# Altium schematic sheet [3] CAN.SchDoc
size A4
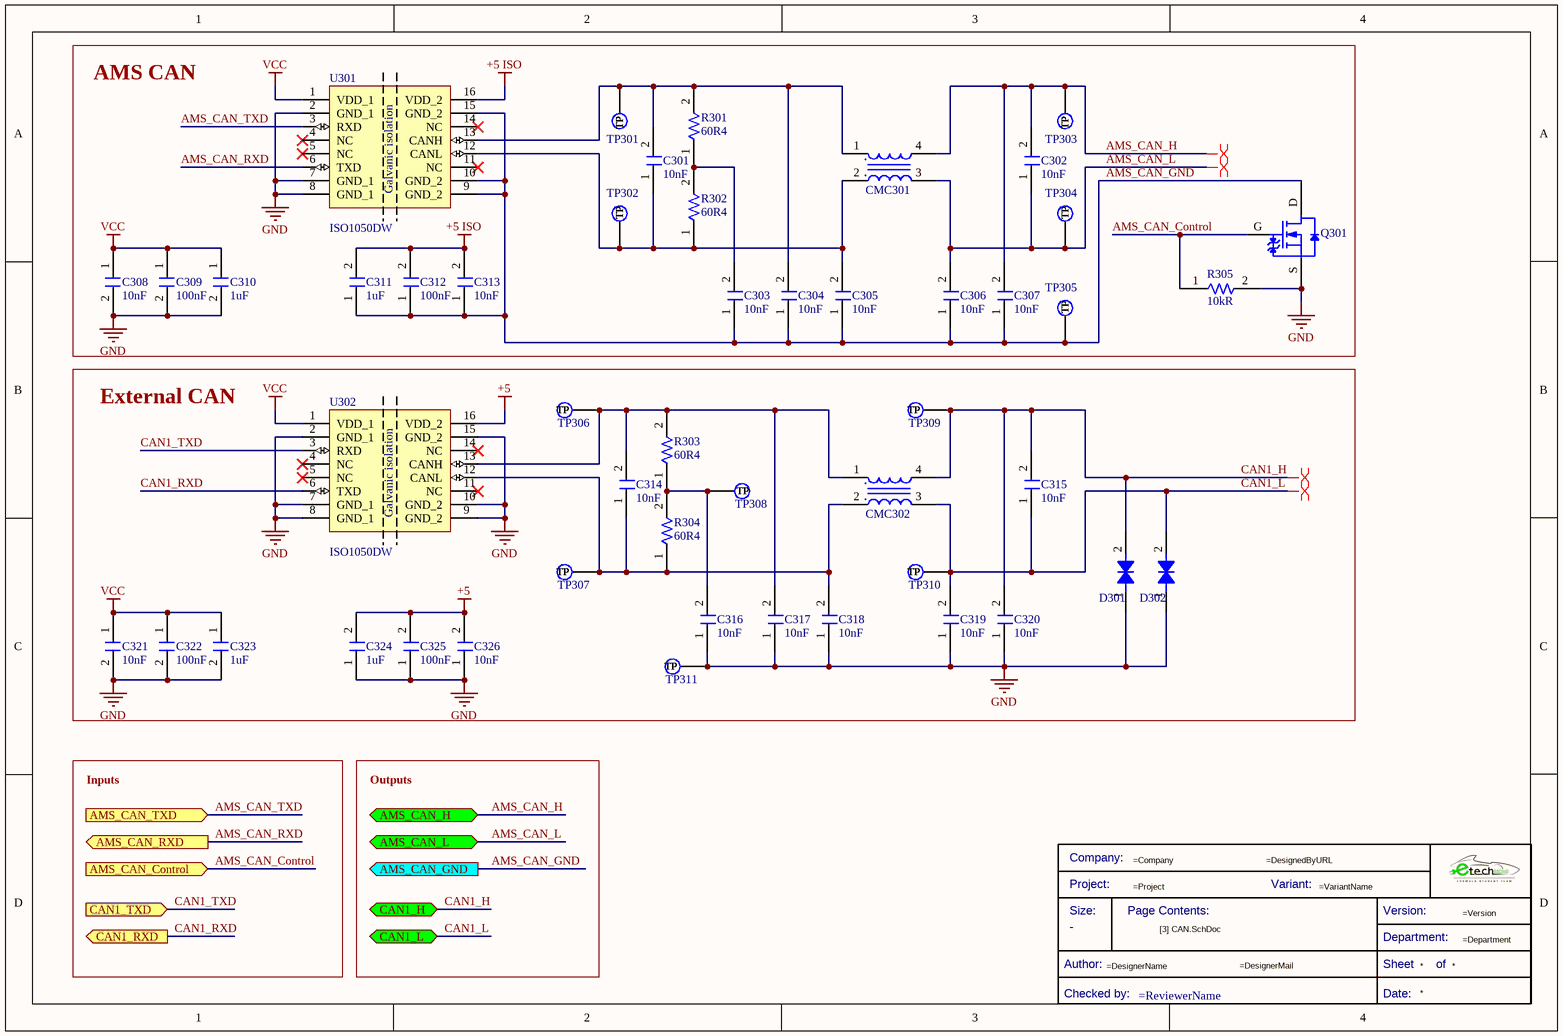
[diagram p0: [3] CAN.SchDoc]

## Parts
*  Title Block_template  (value not drawn)  (graphical)
C301  Capacitance: 10nF  [C0805FNPC-R]  (hidden comment: 885012207092)
C302  Capacitance: 10nF  [C0805FNPC-R]  (hidden comment: 885012207092)
C303  Capacitance: 10nF  [C0805FNPC-R]  (hidden comment: 885012207092)
C304  Capacitance: 10nF  [C0805FNPC-R]  (hidden comment: 885012207092)
C305  Capacitance: 10nF  [C0805FNPC-R]  (hidden comment: 885012207092)
C306  Capacitance: 10nF  [C0805FNPC-R]  (hidden comment: 885012207092)
C307  Capacitance: 10nF  [C0805FNPC-R]  (hidden comment: 885012207092)
C308  Capacitance: 10nF  [C0805FNPC-R]  (hidden comment: 885012207092)
C309  Capacitance: 100nF  [C0805FNPC-R]  (hidden comment: 885012207098)
C310  Capacitance: 1uF  [C0805FNPC-R]  (hidden comment: 885012207103)
C311  Capacitance: 1uF  [C0805FNPC-R]  (hidden comment: 885012207103)
C312  Capacitance: 100nF  [C0805FNPC-R]  (hidden comment: 885012207098)
C313  Capacitance: 10nF  [C0805FNPC-R]  (hidden comment: 885012207092)
C314  Capacitance: 10nF  [C0805FNPC-R]  (hidden comment: 885012207092)
C315  Capacitance: 10nF  [C0805FNPC-R]  (hidden comment: 885012207092)
C316  Capacitance: 10nF  [C0805FNPC-R]  (hidden comment: 885012207092)
C317  Capacitance: 10nF  [C0805FNPC-R]  (hidden comment: 885012207092)
C318  Capacitance: 10nF  [C0805FNPC-R]  (hidden comment: 885012207092)
C319  Capacitance: 10nF  [C0805FNPC-R]  (hidden comment: 885012207092)
C320  Capacitance: 10nF  [C0805FNPC-R]  (hidden comment: 885012207092)
C321  Capacitance: 10nF  [C0805FNPC-R]  (hidden comment: 885012207092)
C322  Capacitance: 100nF  [C0805FNPC-R]  (hidden comment: 885012207098)
C323  Capacitance: 1uF  [C0805FNPC-R]  (hidden comment: 885012207103)
C324  Capacitance: 1uF  [C0805FNPC-R]  (hidden comment: 885012207103)
C325  Capacitance: 100nF  [C0805FNPC-R]  (hidden comment: 885012207098)
C326  Capacitance: 10nF  [C0805FNPC-R]  (hidden comment: 885012207092)
CMC301  744226  [CMC_10u_1.6A]  (value not drawn)
CMC302  744226  [CMC_10u_1.6A]  (value not drawn)
D301  824501600  [DTVS-DO-214AC]  (value not drawn)
D302  824501600  [DTVS-DO-214AC]  (value not drawn)
Q301  CPH3455-TL-H  [TRT-NCH-3/35-CPH]  (value not drawn)
R301  value 60R4  [R0805FTK]  (hidden comment: R60-0805FTN)
R302  value 60R4  [R0805FTK]  (hidden comment: R60-0805FTN)
R303  value 60R4  [R0805FTK]  (hidden comment: R60-0805FTN)
R304  value 60R4  [R0805FTK]  (hidden comment: R60-0805FTN)
R305  Resistance: 10kR  [R0805FTK]  (hidden comment: CR0805-JW-103ELF)
TP301  TestPoint  [TestPoint]  (value not drawn)  (no BOM)
TP302  TestPoint  [TestPoint]  (value not drawn)  (no BOM)
TP303  TestPoint  [TestPoint]  (value not drawn)  (no BOM)
TP304  TestPoint  [TestPoint]  (value not drawn)  (no BOM)
TP305  TestPoint  [TestPoint]  (value not drawn)  (no BOM)
TP306  TestPoint  [TestPoint]  (value not drawn)  (no BOM)
TP307  TestPoint  [TestPoint]  (value not drawn)  (no BOM)
TP308  TestPoint  [TestPoint]  (value not drawn)  (no BOM)
TP309  TestPoint  [TestPoint]  (value not drawn)  (no BOM)
TP310  TestPoint  [TestPoint]  (value not drawn)  (no BOM)
TP311  TestPoint  [TestPoint]  (value not drawn)  (no BOM)
U301  ISO1050DW  [TRANSCEIVER_CAN_SOIC16]
U302  ISO1050DW  [TRANSCEIVER_CAN_SOIC16]

## Blocks framed on the sheet
AMS CAN: C301-C313 CMC301 Q301 R301 R302 R305 TP301-TP305 U301
External CAN: C314-C326 CMC302 D301 D302 R303 R304 TP306-TP311 U302

## Ports
AMS_CAN_Control (in), AMS_CAN_GND (out), AMS_CAN_H (bidir), AMS_CAN_L (bidir), AMS_CAN_RXD (out), AMS_CAN_TXD (in), CAN1_H (bidir), CAN1_L (bidir), CAN1_RXD (out), CAN1_TXD (in)

## Nets
+5: C324.2 C325.2 C326.2 U302.16(VDD_2)
+5 ISO: C311.2 C312.2 C313.2 U301.16(VDD_2)
GND: C308.2 C309.2 C310.2 C316.1 C317.1 C318.1 C319.1 C320.1 C321.2 C322.2 C323.2 C324.1 C325.1 C326.1 D301.1 D302.1 Q301.S R305.2 TP311.1(TP) U301.2(GND_1) U301.7(GND_1) U301.8(GND_1) U302.2(GND_1) U302.7(GND_1) U302.8(GND_1) U302.9(GND_2) U302.10(GND_2) U302.15(GND_2)
VCC: C308.1 C309.1 C310.1 C321.1 C322.1 C323.1 U301.1(VDD_1) U302.1(VDD_1)
AMS_CAN_Control: Q301.G R305.1 ; port AMS_CAN_Control
AMS_CAN_GND: C303.1 C304.1 C305.1 C306.1 C307.1 C311.1 C312.1 C313.1 Q301.D TP305.1(TP) U301.9(GND_2) U301.10(GND_2) U301.15(GND_2) ; port AMS_CAN_GND
AMS_CAN_H: C302.2 C307.2 CMC301.4(4_OUT) TP303.1(TP) ; port AMS_CAN_H
AMS_CAN_L: C302.1 C306.2 CMC301.3(3_OUT) TP304.1(TP) ; port AMS_CAN_L
AMS_CAN_RXD: U301.6(TXD) ; port AMS_CAN_RXD
AMS_CAN_TXD: U301.3(RXD) ; port AMS_CAN_TXD
CAN1_H: C315.2 C320.2 CMC302.4(4_OUT) D301.2 TP309.1(TP) ; port CAN1_H
CAN1_L: C315.1 C319.2 CMC302.3(3_OUT) D302.2 TP310.1(TP) ; port CAN1_L
CAN1_RXD: U302.6(TXD) ; port CAN1_RXD
CAN1_TXD: U302.3(RXD) ; port CAN1_TXD
NetC301_1: C301.1 C305.2 CMC301.2(2_IN) R302.1 TP302.1(TP) U301.12(CANL)
NetC301_2: C301.2 C304.2 CMC301.1(1_IN) R301.2 TP301.1(TP) U301.13(CANH)
NetC303_2: C303.2 R301.1 R302.2
NetC314_1: C314.1 C318.2 CMC302.2(2_IN) R304.1 TP307.1(TP) U302.12(CANL)
NetC314_2: C314.2 C317.2 CMC302.1(1_IN) R303.2 TP306.1(TP) U302.13(CANH)
NetC316_2: C316.2 R303.1 R304.2 TP308.1(TP)

Not connected (* = marked no-connect by the designer): U301 4(NC)* 5(NC)* 11(NC)* 14(NC)*; U302 4(NC)* 5(NC)* 11(NC)* 14(NC)*

## Layout directives
differential pair: AMS_CAN_H, AMS_CAN_L, CAN1_H, CAN1_L

## Notes on the sheet
- Inputs
- Outputs
- Title
- Size:
- Date:
- A4
- Number:
- Time:
- Revision:
- Sheet
- of
- File:
- (in symbol Title Block_template) Company:; Project:; Variant:; Size:; Page Contents:; Version:; Department:; Author:; Sheet; of; Checked by:; Date:
- (in symbol Transceiver_CAN_ISO1050) Galvanic isolation

## Library data of the parts
* = Title Block_template: Standard Title Block; Category: Title Block; Checked by:: =ReviewerName; Size: -
C301-C308 C313-C321 C326 = C10n-50V-0805FNPC-X7R: Cap, 0.01ΜF, 50V, 10%, X7R, 0805; Manufacturer 1: Wurth Electronics; .Creator: DR; Supplier 1: RSComponents; Manufacturer Part Number 1: 885012207092; RoHS: Yes; Category: Ceramic Capacitors; Stock 1: 1; Pricing 1: 4000=0,03200, 12000=0,03100 (USD); Mount: Surface Mount; Case/Package: 0805; Case Code (Metric): 2012; Case Code (Imperial): 0805; Min Operating Temperature: -55°C; Max Operating Temperature: 125°C; Packaging: Cut Tape; Voltage Rating: 50V; Dielectric: X7R; Tolerance: 10%; Voltage Rating (DC): 50V; Length: 0.079inch; Width: 0.049inch; Thickness: 0.035inch; REACH SVHC: Unknown; RoHS Compliant: Yes; ComponentLink1URL: http://www.farnell.com/datasheets/1958497.pdf?src-supplier=Farnell; ComponentLink1Description: http://www.farnell.com/datasheets/1958497.pdf?src-supplier=Farnell; ComponentLink2URL: http://www.farnell.com/datasheets/1958497.pdf?src-supplier=Element14; ComponentLink2Description: http://www.farnell.com/datasheets/1958497.pdf?src-supplier=Element14; ComponentLink3URL: http://www.farnell.com/datasheets/1958497.pdf?src-supplier=Newark; ComponentLink3Description: http://www.farnell.com/datasheets/1958497.pdf?src-supplier=Newark; ComponentLink4URL: https://katalog.we-online.de/pbs/datasheet/885012207092.pdf?src-supplier=Digi-Key; ComponentLink4Description: https://katalog.we-online.de/pbs/datasheet/885012207092.pdf?src-supplier=Digi-Key; Supplier Part Number 1: 1813941
C309 C312 C322 C325 = C100n-50V-0805FNPC-X7R: Cap, 0.1ΜF, 50V, 10%, X7R, 0805; Manufacturer 1: Wurth Electronics; .Creator: DR; Supplier 1: RSComponents; Manufacturer Part Number 1: 885012207098; RoHS: Yes; Category: Ceramic Capacitors; Stock 1: 8000; Pricing 1: 100=0,10200, 500=0,07100, 2000=0,06100 (GBP); Mount: Surface Mount; Case/Package: 0805; Case Code (Metric): 2012; Case Code (Imperial): 0805; Min Operating Temperature: -55°C; Max Operating Temperature: 125°C; Packaging: Cut Tape; Voltage Rating: 50V; Dielectric: X7R; Tolerance: 10%; Voltage Rating (DC): 50V; Length: 0.079inch; Width: 0.049inch; Thickness: 0.035inch; REACH SVHC: Unknown; RoHS Compliant: Yes; ComponentLink1URL: http://www.farnell.com/datasheets/1958498.pdf?src-supplier=Farnell; ComponentLink1Description: http://www.farnell.com/datasheets/1958498.pdf?src-supplier=Farnell; ComponentLink2URL: http://www.farnell.com/datasheets/1958498.pdf?src-supplier=Element14; ComponentLink2Description: http://www.farnell.com/datasheets/1958498.pdf?src-supplier=Element14; ComponentLink3URL: https://katalog.we-online.de/pbs/datasheet/885012207098.pdf?src-supplier=Digi-Key; ComponentLink3Description: https://katalog.we-online.de/pbs/datasheet/885012207098.pdf?src-supplier=Digi-Key; ComponentLink4URL: http://www.farnell.com/datasheets/1958498.pdf?src-supplier=Newark; ComponentLink4Description: http://www.farnell.com/datasheets/1958498.pdf?src-supplier=Newark; Supplier Part Number 1: 1813493
C310 C311 C323 C324 = C1u-50V-0805FNPC-X7R: Multilayer Ceramic Capacitor, Wcap-Csgp Series, 1 F, 10%, X7R, 50 V, 0805 [2012 Metric] Rohs Compliant: Yes; Manufacturer 1: Wurth Electronics; Voltage Rating: 50V; .Creator: GP; Supplier 1: RSComponents; Manufacturer Part Number 1: 885012207103; RoHS: Yes; Category: Ceramic Capacitors; Stock 1: 5100; Pricing 1: 50=0,27200, 250=0,25300, 500=0,22800, 1250=0,20100, 2500=0,17100 (GBP); Mount: Surface Mount; Case/Package: 0805; Case Code (Metric): 2012; Case Code (Imperial): 0805; Min Operating Temperature: -55°C; Max Operating Temperature: 85°C; Packaging: Cut Tape; Dielectric: X7R; Tolerance: 10%; Voltage Rating (DC): 50V; Length: 0.079inch; Width: 0.049inch; Thickness: 0.053inch; REACH SVHC: Unknown; RoHS Compliant: Yes; ComponentLink1URL: http://www.farnell.com/datasheets/1958501.pdf?src-supplier=Farnell; ComponentLink1Description: http://www.farnell.com/datasheets/1958501.pdf?src-supplier=Farnell; ComponentLink2URL: http://www.farnell.com/datasheets/1958501.pdf?src-supplier=Element14; ComponentLink2Description: http://www.farnell.com/datasheets/1958501.pdf?src-supplier=Element14; ComponentLink3URL: https://katalog.we-online.de/pbs/datasheet/885012107003.pdf?src-supplier=Digi-Key; ComponentLink3Description: https://katalog.we-online.de/pbs/datasheet/885012107003.pdf?src-supplier=Digi-Key; ComponentLink4URL: http://www.farnell.com/datasheets/1958501.pdf?src-supplier=Newark; ComponentLink4Description: http://www.farnell.com/datasheets/1958501.pdf?src-supplier=Newark; Supplier Part Number 1: 1813523
CMC301 CMC302 = CMC_10u_1.6A: Common Mode Chokes Dual 10uH 920Ohm 1kHz 1.6A 80mOhm DCR SMD T/R; Manufacturer: Wurth Electronics; Core Material: Ferrite; Voltage Rating: 80V; Tolerance: 30%; Impedance: 920R; Resistance: 80mR; Number of Lines: 2; .Creator: GP; Category: Common Mode Line Filter; ComponentLink1Description: Datasheet; ComponentLink1URL: https://www.we-online.com/catalog/datasheet/744226.pdf; ComponentLink2Description: Where buy it; ComponentLink2URL: https://www.we-online.com/catalog/en/WE-SL2?sq=744226#744226; Supplier 1: Digi-Key; Manufacturer Part Number: 744226; RoHS: Yes; Stock 1: 1943; Pricing 1: 1=2,55000, 10=2,51500, 50=2,27200, 100=2,19100, 500=2,02900 (USD); Mount: Surface Mount; Case/Package: SMD/SMT; Number of Pins: 4; Weight: 0.017672oz; Min Operating Temperature: -40°C; Max Operating Temperature: 125°C; Packaging: Tape and Reel; Package Quantity: 1; Termination: SMD/SMT; Series: WE-SL2; Inductance: 10uH; Voltage Rating (DC): 80V; Current Rating: 1.6A; Max DC Current: 1.6A; DC Resistance (DCR): 80mR; Test Frequency: 1kHz; Current: 1.6A; Inductance Tolerance: 30%; DC Current: 1.6A; Length: 9.2mm; Width: 6mm; Height: 5mm; Depth: 6.3mm; RoHS Compliant: Yes; REACH SVHC: No SVHC; Lead Free: Lead Free; Supplier Part Number 1: 732-1475-1-ND
D301 D302 = DTVS-6V-DO-214AC: TVS diode [Würth Elektronik] 824501600 TVS diode; Manufacturer: Wurth Electronics; Number of Bidirectional Channels: 1; Reverse Standoff Voltage: 6V; Min Breakdown Voltage: 7.02V; Clamping Voltage: 10.3V; Peak Pulse Power: 400W; Power Line Protection: No; Polarity: Bidirectional; Peak Pulse Current: 38.8A; .Creator: DO; ComponentLink1Description: Where buy it; ComponentLink1URL: https://www.we-online.com/catalog/en/WE-TVSP?sq=824501600#824501600; Supplier 1: Mouser; Manufacturer Part Number: 824501600; RoHS: Yes; Category: TVS Diodes; Stock 1: 780; Pricing 1: 1=0,28000, 10=0,26100, 50=0,26100, 100=0,23400, 500=0,20400, 1000=0,17400, 10000=0,17400 (USD); Mount: Surface Mount; Number of Pins: 2; Min Operating Temperature: -65°C; Max Operating Temperature: 150°C; Packaging: Cut Tape; Max Breakdown Voltage: 7.02V; Resistor Type: Zener; REACH SVHC: Unknown; RoHS Compliant: Yes; ComponentLink2URL: http://www.farnell.com/datasheets/2036401.pdf?src-supplier=Element14; ComponentLink2Description: http://www.farnell.com/datasheets/2036401.pdf?src-supplier=Element14; Supplier Part Number 1: 710-824501600; ComponentLink3URL: https://katalog.we-online.de/pbs/datasheet/824501600.pdf?src-supplier=Digi-Key; ComponentLink3Description: https://katalog.we-online.de/pbs/datasheet/824501600.pdf?src-supplier=Digi-Key
Q301 = TRT-NCH-3/35-CPH: CPH3455-TL-H N-channel MOSFET Transistor; 3 A; 35 V; 3-Pin CPH; Manufacturer: ON Semiconductor; Rds On Max: 104mR; Input Capacitance: 186pF; Rise Time: 4.7ns; Drain to Source Voltage (Vdss): 35V; Continuous Drain Current (ID): 3A; Max Power Dissipation: 1W; Drain to Source Resistance: 108mR; Turn-On Delay Time: 4.2ns; Turn-Off Delay Time: 15ns; Fall Time: 5.7ns; Element Configuration: Single; Gate to Source Voltage (Vgs): 20V; .Creator: GP; Category: Transistor; ComponentLink1Description: Datasheet; ComponentLink1URL: https://docs.rs-online.com/5847/0900766b812d514d.pdf; ComponentLink2Description: Where buy it; ComponentLink2URL: https://es.rs-online.com/web/p/mosfet/8009989; Supplier 1: RSComponents; Manufacturer Part Number: CPH3455-TL-H; RoHS: Yes; Stock 1: 1; Pricing 1: 50=0,50400 (USD); Case/Package: SC; Number of Pins: 3; Min Operating Temperature: -55°C; Max Operating Temperature: 150°C; Package Quantity: 3000; Packaging: Tape and Reel; Drain to Source Breakdown Voltage: 35V; Power Dissipation: 1W; Polarity: N-CHANNEL; Series: -; Length: 2.9mm; Width: 1.6mm; Height: 0.9mm; Lead Free: Lead Free; Halogen Free: Halogen Free; RoHS Compliant: Yes; ComponentLink3URL: https://datasheet.ciiva.com/947/cph3455-d-947201.pdf?src-supplier=Digi-Key; ComponentLink3Description: https://datasheet.ciiva.com/947/cph3455-d-947201.pdf?src-supplier=Digi-Key; ComponentLink4URL: https://datasheet.ciiva.com/4444/cph3455-d-91653-4444616.pdf?src-supplier=Mouser; ComponentLink4Description: https://datasheet.ciiva.com/4444/cph3455-d-91653-4444616.pdf?src-supplier=Mouser; ComponentLink5URL: https://datasheet.ciiva.com/11164/cph3455-d-11164889.pdf?src-supplier=Avnet; ComponentLink5Description: https://datasheet.ciiva.com/11164/cph3455-d-11164889.pdf?src-supplier=Avnet; Supplier Part Number 1: 8009989
R301-R304 = R60-0805FTN: Res Thin Film 0805 60.4 Ohm 0.1% 1/8W ±25ppm/°C Molded SMD SMD Punched Carrier T/R; Manufacturer 1: Panasonic; Manufacturer Part Number 1: ERA-6AEB60R4V; Resistance: 60.4R; Voltage Rating (DC): 100V; Max Power Dissipation: 125mW; Voltage Rating: 200V; .Creator: DR; Supplier 1: Arrow Electronics; RoHS: Yes; Category: Chip SMD Resistors; Stock 1: 5000; Pricing 1: 1=0,04650, 10=0,03900, 100=0,02860 (USD); Mount: Surface Mount; Case/Package: 0805; Number of Pins: 2; Contact Plating: Tin; Weight: 0.000194oz; Case Code (Metric): 2012; Case Code (Imperial): 0805; Min Operating Temperature: -55°C; Max Operating Temperature: 155°C; Temperature Coefficient: 25ppm/°C; Tolerance: 0.1%; Resistor Type: Thin Film,Metal Film; Features: Automotive AEC-Q200; Package Quantity: 5000; Number of Terminations: 2; Termination: SMD/SMT; Power Rating: 125mW; Packaging: Tape and Reel; Length: 2mm; Width: 1.25mm; Height: 0.5mm; Depth: 1.25mm; Radiation Hardening: No; Lead Free: Lead Free; ComponentLink1URL: https://datasheet.ciiva.com/11811/0900766b80eb1d8c-11811180.pdf?src-supplier=RSComponents; ComponentLink1Description: https://datasheet.ciiva.com/11811/0900766b80eb1d8c-11811180.pdf?src-supplier=RSComponents; ComponentLink2URL: https://datasheet.ciiva.com/41450/001181146-da-01-en-widerstand-era-0805-60r4-0-1-5000st-41450303.pdf?src-supplier=Conrad; ComponentLink2Description: https://datasheet.ciiva.com/41450/001181146-da-01-en-widerstand-era-0805-60r4-0-1-5000st-41450303.pdf?src-supplier=Conrad; ComponentLink3URL: https://datasheet.ciiva.com/5951/485442-5951173.pdf?src-supplier=Farnell; ComponentLink3Description: https://datasheet.ciiva.com/5951/485442-5951173.pdf?src-supplier=Farnell; ComponentLink4URL: https://datasheet.ciiva.com/30184/54aoa0000ce26-30184022.pdf?src-supplier=Onlinecomponents.com; ComponentLink4Description: https://datasheet.ciiva.com/30184/54aoa0000ce26-30184022.pdf?src-supplier=Onlinecomponents.com; ComponentLink5URL: https://datasheet.ciiva.com/9188/aoa0000ce26-9188476.pdf?src-supplier=Avnet; ComponentLink5Description: https://datasheet.ciiva.com/9188/aoa0000ce26-9188476.pdf?src-supplier=Avnet; Supplier Part Number 1: ERA-6AEB60R4V
R305 = R10k-0805FTK: BOURNS         CR0805-JW-103ELF            Surface Mount Chip Resistor, Thick Film, CR Series, 10 kohm, 125 mW,  5%, 150 V; Temperature Coefficient: 200ppm/°C; Power Rating: 125mW; Voltage Rating: 150V; Voltage Rating (DC): 100V; .Creator: DR; Supplier 1: Arrow Electronics; Manufacturer 1: Bourns; Manufacturer Part Number 1: CR0805-JW-103ELF; RoHS: Yes; Category: Chip SMD Resistors; Stock 1: 57566; Pricing 1: 1=0,05790, 10=0,01540, 25=0,01340, 100=0,00340 (USD); Mount: Surface Mount; Case/Package: 0805; Number of Pins: 2; Contact Plating: Tin; Case Code (Metric): 2012; Case Code (Imperial): 0805; Min Operating Temperature: -55°C; Max Operating Temperature: 155°C; Tolerance: 5%; Resistor Type: Thick Film; Package Quantity: 1; Packaging: Tape and Reel; Number of Terminations: 2; Termination: SMD/SMT; Max Power Dissipation: 125mW; Features: Moisture Resistant; Series: CR0805; Construction: Rectangular; Resistance Tolerance: 5%; Technology: THICK FILM; Length: 2mm; Width: 1.25mm; Height: 0.5mm; Depth: 1.25mm; Thickness: 508um; Radiation Hardening: No; REACH SVHC: No SVHC; Military Standard: Not; RoHS Compliant: Yes; ComponentLink1URL: https://datasheet.ciiva.com/11821/0900766b80fcdb72-11821135.pdf?src-supplier=RSComponents; ComponentLink1Description: https://datasheet.ciiva.com/11821/0900766b80fcdb72-11821135.pdf?src-supplier=RSComponents; ComponentLink2URL: https://datasheet.ciiva.com/9122/chpreztr-9122374.pdf?src-supplier=Avnet; ComponentLink2Description: https://datasheet.ciiva.com/9122/chpreztr-9122374.pdf?src-supplier=Avnet; ComponentLink3URL: https://datasheet.ciiva.com/22693/1902866-22693254.pdf?src-supplier=Element14; ComponentLink3Description: https://datasheet.ciiva.com/22693/1902866-22693254.pdf?src-supplier=Element14; ComponentLink4URL: https://datasheet.ciiva.com/7986/691949-7986187.pdf?src-supplier=Element14; ComponentLink4Description: https://datasheet.ciiva.com/7986/691949-7986187.pdf?src-supplier=Element14; ComponentLink5URL: https://datasheet.ciiva.com/30065/159chpreztr-30065976.pdf?src-supplier=Onlinecomponents.com; ComponentLink5Description: https://datasheet.ciiva.com/30065/159chpreztr-30065976.pdf?src-supplier=Onlinecomponents.com; ComponentLink6URL: https://datasheet.ciiva.com/16783/70154685-16783482.pdf?src-supplier=Allied+Electronics; ComponentLink6Description: https://datasheet.ciiva.com/16783/70154685-16783482.pdf?src-supplier=Allied+Electronics; ComponentLink7URL: https://datasheet.ciiva.com/5548/chpreztr-5548491.pdf?src-supplier=Mouser; ComponentLink7Description: https://datasheet.ciiva.com/5548/chpreztr-5548491.pdf?src-supplier=Mouser; ComponentLink8URL: https://datasheet.ciiva.com/6559/chpreztr-6559900.pdf?src-supplier=Digi-Key; ComponentLink8Description: https://datasheet.ciiva.com/6559/chpreztr-6559900.pdf?src-supplier=Digi-Key; ComponentLink9URL: https://datasheet.ciiva.com/6559/chpreztr-6559901.pdf?src-supplier=Digi-Key; ComponentLink9Description: https://datasheet.ciiva.com/6559/chpreztr-6559901.pdf?src-supplier=Digi-Key; ComponentLink10URL: https://datasheet.ciiva.com/7985/1856384-7985869.pdf?src-supplier=Element14; ComponentLink10Description: https://datasheet.ciiva.com/7985/1856384-7985869.pdf?src-supplier=Element14; ComponentLink11URL: https://datasheet.ciiva.com/48692/001055517-da-01-en-smd-wid-cr0805-jw-103elf-10k-ohm-1-8w-48692118.pdf?src-supplier=Conrad; ComponentLink11Description: https://datasheet.ciiva.com/48692/001055517-da-01-en-smd-wid-cr0805-jw-103elf-10k-ohm-1-8w-48692118.pdf?src-supplier=Conrad; Supplier Part Number 1: CR0805-JW-103ELF
TP301-TP311 = TestPoint: Test Point 1x1 mm; .Creator: GP; Category: TestPoint; .PCBcheck: GP; .SCHcheck: GP
U301 U302 = Transceiver_CAN_ISO1050: Isolated 5-V CAN transceiver 16-SOIC -55 to 105; Manufacturer 1: Texas Instruments; Data Rate: 1Mbps; Number of Transceivers: 1; Propagation Delay: 74ns; Min Supply Voltage: 3V; Max Supply Voltage: 5.5V; Working Voltage: 1.2V; Polarity: Unidirectional; Operating Supply Current: 2mA; Max Supply Current: 73mA; .Creator: DR; ComponentLink1URL: https://datasheet.ciiva.com/22630/1719733-22630777.pdf?src-supplier=Element14; ComponentLink1Description: Datasheet; ComponentLink2Description: Where buy it; ComponentLink2URL: Try again in 2023; Supplier 1: Arrow Electronics; Manufacturer Part Number 1: ISO1050DW; RoHS: Yes; Category: Interface ICs; Stock 1: 60; Pricing 1: 1=4,02740 (USD); Case/Package: SOIC; Number of Pins: 16; Contact Plating: Gold; Weight: 0.019312oz; Min Operating Temperature: -55°C; Max Operating Temperature: 105°C; Packaging: Bulk; Package Quantity: 40; Number of Channels: 1; Number of Drivers: 1; Series: -; Number of Transmit Buffers: 1; Number of Receive Buffers: 1; Length: 10.5mm; Width: 7.6mm; Height: 2.35mm; Radiation Hardening: No; Lead Free: Lead Free; RoHS Compliant: Yes; REACH SVHC: No SVHC; ComponentLink3URL: https://datasheet.ciiva.com/22630/1719733-22630777.pdf?src-supplier=Element14; ComponentLink3Description: https://datasheet.ciiva.com/22630/1719733-22630777.pdf?src-supplier=Element14; ComponentLink4URL: https://datasheet.ciiva.com/26830/iso1050dw-26830433.pdf?src-supplier=IIIC; ComponentLink4Description: https://datasheet.ciiva.com/26830/iso1050dw-26830433.pdf?src-supplier=IIIC; ComponentLink5URL: https://datasheet.ciiva.com/1772/iso1050-1772965.pdf?src-supplier=Digi-Key; ComponentLink5Description: https://datasheet.ciiva.com/1772/iso1050-1772965.pdf?src-supplier=Digi-Key; Supplier Part Number 1: ISO1050DW